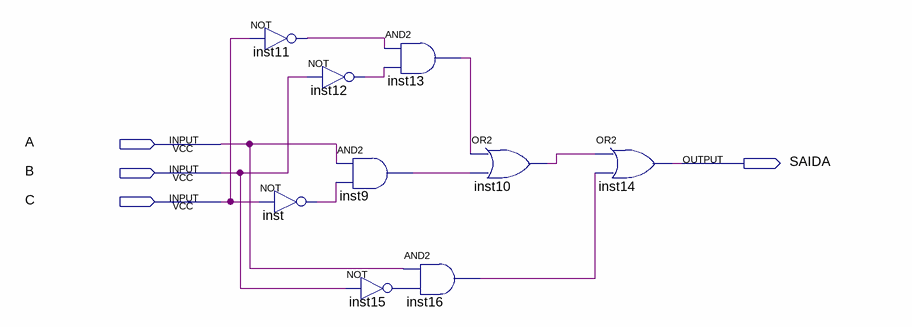
[diagram p0: schematic sheet]
// Quartus schematic Comp_Me_bitsinal.bdf as structural Verilog: 9 symbols, 4 pins
module Comp_Me_bitsinal (
  input  A,
  input  B,
  input  C,
  output SAIDA
);

  wire inst9_out, inst10_out, inst11_out, inst12_out, inst13_out, inst15_out, inst16_out, inst_out;

  not inst11 (inst11_out, C);
  not inst (inst_out, C);
  not inst12 (inst12_out, B);
  and inst9 (inst9_out, A, inst_out);
  not inst15 (inst15_out, B);
  and inst13 (inst13_out, inst11_out, inst12_out);
  and inst16 (inst16_out, A, inst15_out);
  or inst10 (inst10_out, inst13_out, inst9_out);
  or inst14 (SAIDA, inst10_out, inst16_out);
endmodule
